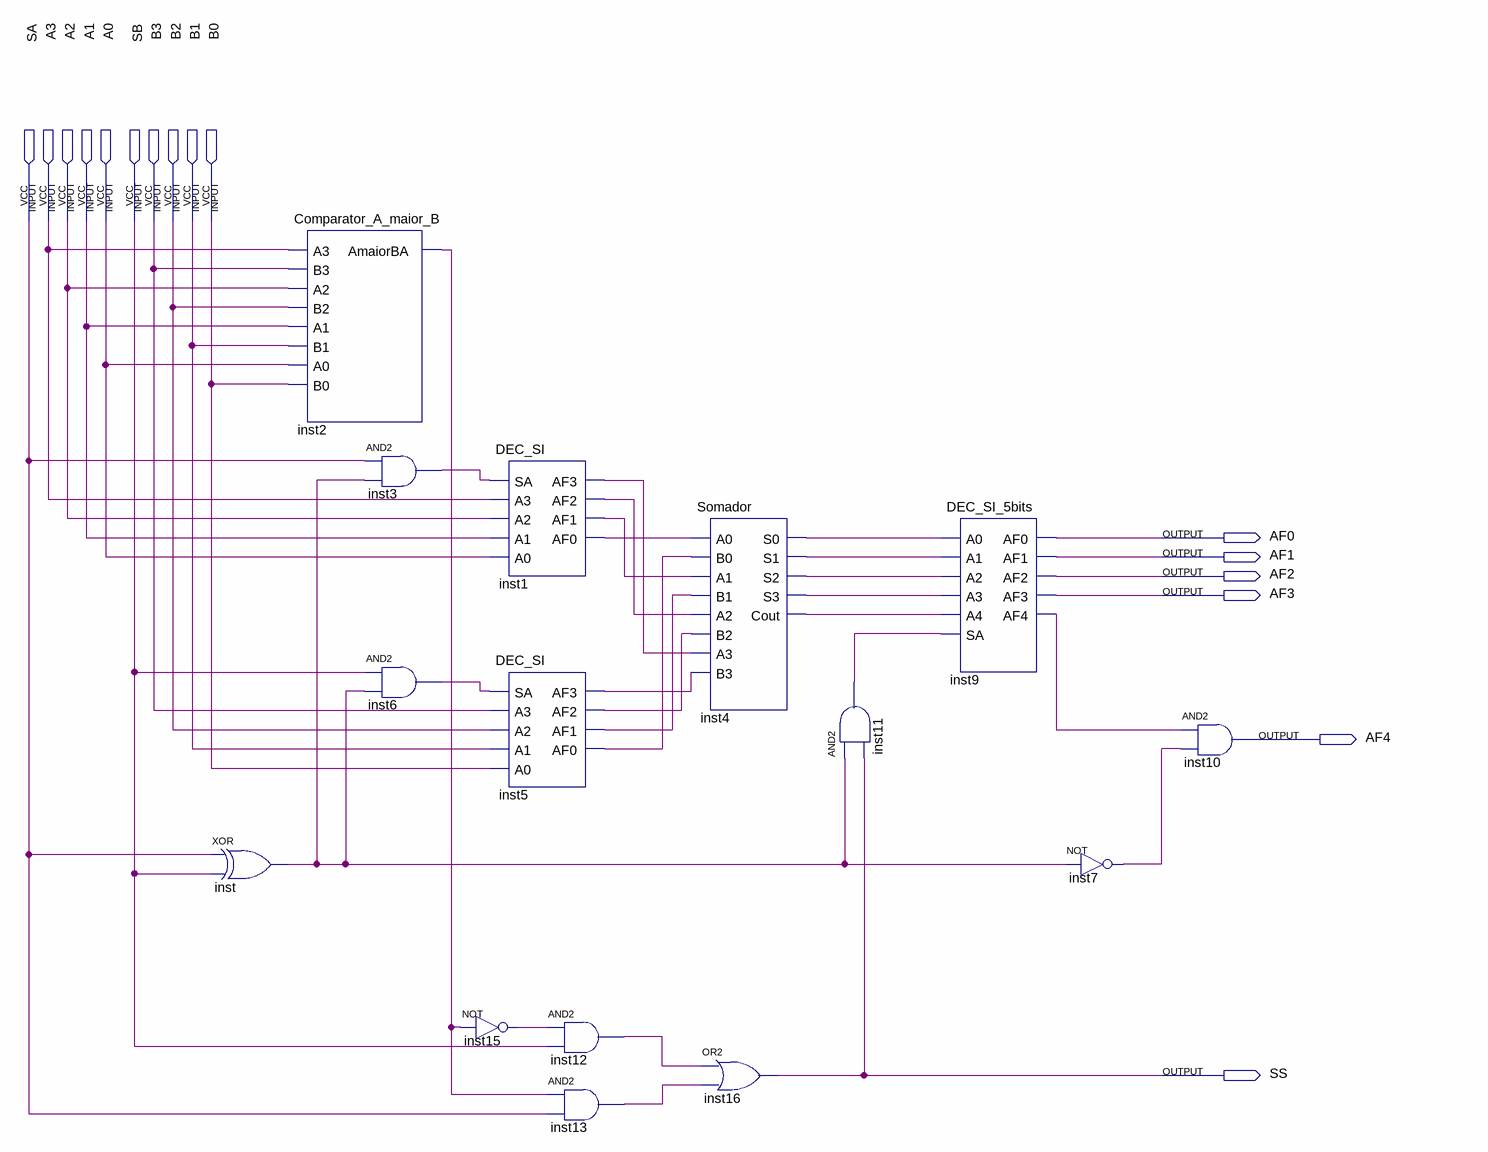
[diagram p0: schematic sheet]
// Quartus schematic A_mais_B.bdf as structural Verilog: 15 symbols, 16 pins
module A_mais_B (
  input  SA,
  input  A3,
  input  A2,
  input  A1,
  input  A0,
  input  SB,
  input  B3,
  input  B2,
  input  B1,
  input  B0,
  output AF0,
  output AF1,
  output AF2,
  output AF3,
  output AF4,
  output SS
);

  wire inst1_af0, inst1_af1, inst1_af2, inst1_af3, inst2_amaiorba, inst3_out, inst4_cout, inst4_s0, inst4_s1,
       inst4_s2, inst4_s3, inst5_af0, inst5_af1, inst5_af2, inst5_af3, inst6_out, inst7_out, inst9_af4,
       inst11_out, inst12_out, inst13_out, inst15_out, inst_out;

  xor inst (inst_out, SA, SB);
  Comparator_A_maior_B inst2 (
    .A3(A3), .B3(B3), .A2(A2), .B2(B2), .A1(A1), .B1(B1), .A0(A0), .B0(B0), .AmaiorBA(inst2_amaiorba));
  and inst3 (inst3_out, SA, inst_out);
  and inst6 (inst6_out, SB, inst_out);
  DEC_SI inst1 (
    .SA(inst3_out), .A3(A3), .A2(A2), .A1(A1), .A0(A0), .AF3(inst1_af3), .AF2(inst1_af2), .AF1(inst1_af1),
    .AF0(inst1_af0));
  DEC_SI inst5 (
    .SA(inst6_out), .A3(B3), .A2(B2), .A1(B1), .A0(B0), .AF3(inst5_af3), .AF2(inst5_af2), .AF1(inst5_af1),
    .AF0(inst5_af0));
  not inst15 (inst15_out, inst2_amaiorba);
  and inst12 (inst12_out, inst15_out, SB);
  and inst13 (inst13_out, inst2_amaiorba, SA);
  Somador inst4 (
    .A0(inst1_af0), .B0(inst5_af0), .A1(inst1_af1), .B1(inst5_af1), .A2(inst1_af2), .B2(inst5_af2),
    .A3(inst1_af3), .B3(inst5_af3), .S0(inst4_s0), .S1(inst4_s1), .S2(inst4_s2), .S3(inst4_s3),
    .Cout(inst4_cout));
  or inst16 (SS, inst12_out, inst13_out);
  and inst11 (inst11_out, inst_out, SS);
  DEC_SI_5bits inst9 (
    .SA(inst11_out), .A3(inst4_s3), .A2(inst4_s2), .A1(inst4_s1), .A0(inst4_s0), .A4(inst4_cout),
    .AF4(inst9_af4), .AF3(AF3), .AF2(AF2), .AF1(AF1), .AF0(AF0));
  not inst7 (inst7_out, inst_out);
  and inst10 (AF4, inst9_af4, inst7_out);
endmodule
